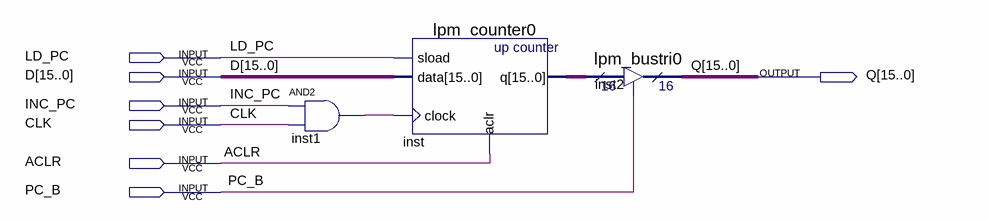
[diagram p0: schematic sheet]
// Quartus schematic pc.bdf as structural Verilog: 3 symbols, 7 pins
module pc (
  input  LD_PC,
  input  [15:0] D,
  input  INC_PC,
  input  CLK,
  input  ACLR,
  input  PC_B,
  output [15:0] Q
);

  wire inst1_out;
  wire [15:0] inst_q;

  and inst1 (inst1_out, INC_PC, CLK);
  lpm_counter0 inst (.sload(LD_PC), .data(D), .clock(inst1_out), .aclr(ACLR), .q(inst_q));
  lpm_bustri0 inst2 (.enabledt(PC_B), .data(inst_q), .tridata(Q));
endmodule
